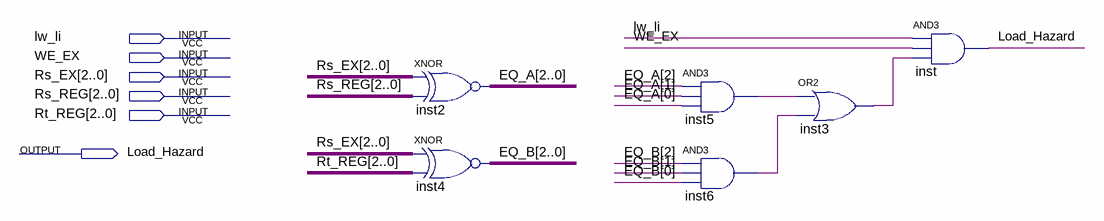
[diagram p0: schematic sheet]
// Quartus schematic Load_Hazard_Detection_Unit.bdf as structural Verilog: 6 symbols, 6 pins
module Load_Hazard_Detection_Unit (
  input  lw_li,
  input  WE_EX,
  input  [2:0] Rs_EX,
  input  [2:0] Rs_REG,
  input  [2:0] Rt_REG,
  output Load_Hazard
);

  wire inst3_out, inst5_out, inst6_out;
  wire [2:0] EQ_A, EQ_B;

  assign EQ_A = ~(Rs_EX ^ Rs_REG);  // XNOR inst2, 3 bits wide
  assign EQ_B = ~(Rs_EX ^ Rt_REG);  // XNOR inst4, 3 bits wide
  and inst5 (inst5_out, EQ_A[2], EQ_A[1], EQ_A[0]);
  and inst6 (inst6_out, EQ_B[2], EQ_B[1], EQ_B[0]);
  or inst3 (inst3_out, inst5_out, inst6_out);
  and inst (Load_Hazard, lw_li, WE_EX, inst3_out);
endmodule
